# Altium schematic sheet Pro_Micro_582V0.1.SchDoc
size A3; SheetNumber: 1; SheetTotal: 1
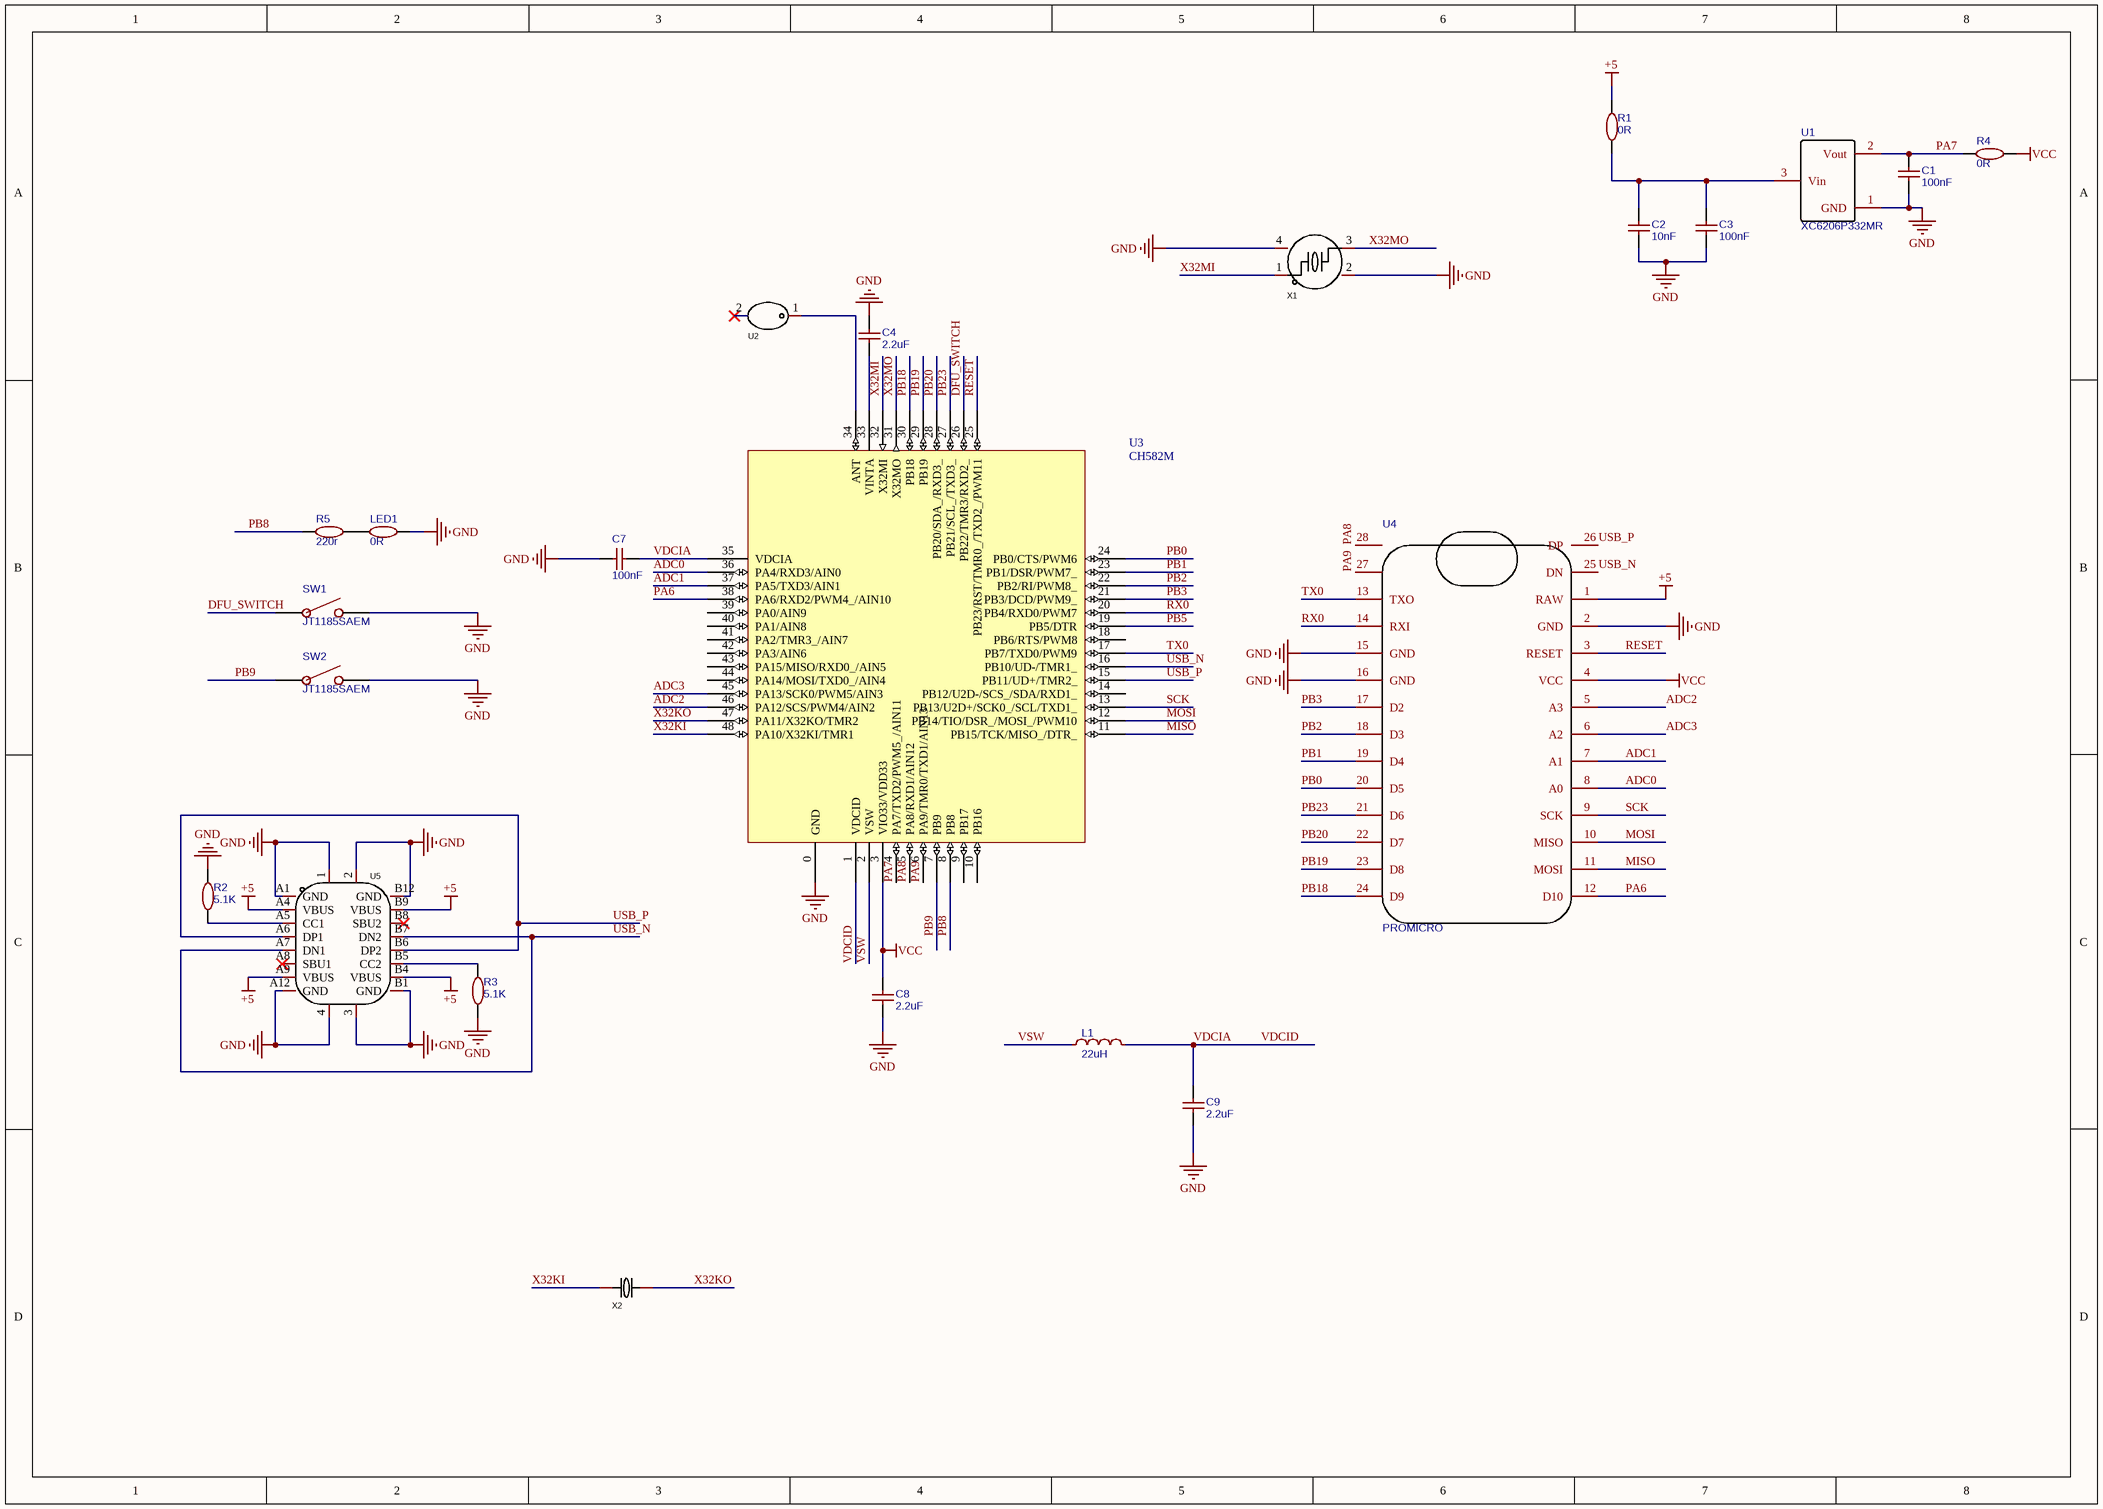
[diagram p0: Pro_Micro_582V0.1.SchDoc]

## Parts
C1  100nF  [C0402]
C2  10nF  [C0402]
C3  100nF  [C0402]
C4  2.2uF  [C0402]
C7  100nF  [C0402]
C8  2.2uF  [C0402]
C9  2.2uF  [C0402]
L1  22uH  [L0805]
LED1  0R  [C0402]
R1  0R  [R0402]
R2  5.1K  [R0402]
R3  5.1K  [R0402]
R4  0R  [R0402]
R5  220r  [C0402]
SW1  JT1185SAEM  [SW-SMD_L3.9-W2.9-P4.15-LS5.0]
SW2  JT1185SAEM  [SW-SMD_L3.9-W2.9-P4.15-LS5.0]
U1  XC6206P332MR  [SOT-23-3_L2.9-W1.6-P1.90-LS2.8-BR]
U2  RFANT3216120A5T  [FILTER-SMD_1206-2P-L3.2-W1.6-L]  (value not drawn)
U3  CH582M  [QFN48_5X5]
U4  PROMICRO  [PROMICRO邮票孔]
U5  20009-UCAF001-X  [TYPE-C-SMD_20009-UCAF001-X]  (value not drawn)
X1  X201632MOB4SI  [CRYSTAL-SMD_4P-L2.0-W1.6-BL-2]  (value not drawn)
X2  SC-32S32.768kHz20PPM12.5pF  [OSC-SMD_L3.2-W1.5]  (value not drawn)

## Nets
+5: R1.2 U4.1(RAW) U5.A4(VBUS) U5.A9(VBUS) U5.B4(VBUS) U5.B9(VBUS)
GND: C1.1 C2.1 C3.1 C4.2 C7.2 C8.1 C9.1 LED1.1 R2.2 R3.2 SW1.2 SW2.2 U1.1(GND) U3.0(GND) U4.2(GND) U4.15(GND) U4.16(GND) U5.1 U5.2 U5.3 U5.4 U5.A1(GND) U5.A12(GND) U5.B1(GND) U5.B12(GND) X1.2(GND) X1.4(GND)
VCC: C8.2 R4.1 U3.3(VIO33/VDD33) U4.4(VCC)
ADC0: U3.36(PA4/RXD3/AIN0) U4.8(A0)
ADC1: U3.37(PA5/TXD3/AIN1) U4.7(A1)
ADC2: U3.46(PA12/SCS/PWM4/AIN2) U4.5(A3)
ADC3: U3.45(PA13/SCK0/PWM5/AIN3) U4.6(A2)
DFU_SWITCH: SW1.1 U3.26(PB22/TMR3/RXD2_)
MISO: U3.11(PB15/TCK/MISO_/DTR_) U4.11(MOSI)
MOSI: U3.12(PB14/TIO/DSR_/MOSI_/PWM10) U4.10(MISO)
PA6: U3.38(PA6/RXD2/PWM4_/AIN10) U4.12(D10)
PA7: C1.2 R4.2 U1.2(Vout) U3.4(PA7/TXD2/PWM5_/AIN11)
PA8: U3.5(PA8/RXD1/AIN12) U4.28
PA9: U3.6(PA9/TMR0/TXD1/AIN13) U4.27
PB0: U3.24(PB0/CTS/PWM6) U4.20(D5)
PB1: U3.23(PB1/DSR/PWM7_) U4.19(D4)
PB2: U3.22(PB2/RI/PWM8_) U4.18(D3)
PB3: U3.21(PB3/DCD/PWM9_) U4.17(D2)
PB5: U3.19(PB5/DTR)
PB8: R5.1 U3.8(PB8)
PB9: SW2.1 U3.7(PB9)
PB18: U3.30(PB18) U4.24(D9)
PB19: U3.29(PB19) U4.23(D8)
PB20: U3.28(PB20/SDA_/RXD3_) U4.22(D7)
PB23: U3.27(PB21/SCL_/TXD3_) U4.21(D6)
RESET: U3.25(PB23/RST/TMR0_/TXD2_/PWM11) U4.3(RESET)
RX0: U3.20(PB4/RXD0/PWM7) U4.14(RXI)
SCK: U3.13(PB13/U2D+/SCK0_/SCL/TXD1_) U4.9(SCK)
TX0: U3.17(PB7/TXD0/PWM9) U4.13(TXO)
USB_N: U3.16(PB10/UD-/TMR1_) U4.25(DN) U5.A7(DN1) U5.B7(DN2)
USB_P: U3.15(PB11/UD+/TMR2_) U4.26(DP) U5.A6(DP1) U5.B6(DP2)
VDCIA: C7.1 C9.2 L1.2 U3.1(VDCID) U3.35(VDCIA)  [also labelled VDCID]
VSW: L1.1 U3.2(VSW)
X32KI: U3.48(PA10/X32KI/TMR1) X2.1
X32KO: U3.47(PA11/X32KO/TMR2) X2.2
X32MI: U3.32(X32MI) X1.1
X32MO: U3.31(X32MO) X1.3
NetC2_2: C2.2 C3.2 R1.1 U1.3(Vin)
NetC4_1: C4.1 U3.33(VINTA)
NetLED1_2: LED1.2 R5.2
NetR2_1: R2.1 U5.A5(CC1)
NetR3_1: R3.1 U5.B5(CC2)
NetU2_1: U2.1 U3.34(ANT)

Not connected (* = marked no-connect by the designer): U2 2*; U3 9(PB17) 10(PB16) 14(PB12/U2D-/SCS_/SDA/RXD1_) 18(PB6/RTS/PWM8) 39(PA0/AIN9) 40(PA1/AIN8) 41(PA2/TMR3_/AIN7) 42(PA3/AIN6) 43(PA15/MISO/RXD0_/AIN5) 44(PA14/MOSI/TXD0_/AIN4); U5 A8(SBU1)* B8(SBU2)*

## Library data of the parts
C1-C4 C7-C9 = 电容: BOM_Manufacturer: YAGEO; BOM_Manufacturer Part: CC0805KKX5R6BB106; nameAlias: Capacitance; BOM_Supplier: LCSC; BOM_Supplier Part: C89832; spicePre: C; spiceSymbolName: CC0805KKX5R6BB106
L1 = 22uH: BOM_Manufacturer: TAIYO YUDEN(太诱); BOM_Manufacturer Part: CBC2012T220K; nameAlias: Inductance; Contributor: LCSC; BOM_Supplier: LCSC; BOM_Supplier Part: C223184; BOM_JLCPCB Part Class: Extended Part; spicePre: L; spiceSymbolName: CBC2012T220K
LED1 R1-R5 = 电阻: BOM_Manufacturer: UniOhm; BOM_Manufacturer Part: 0603WAF1002T5E; nameAlias: Resistance; Resistance (Ohms): 10K; BOM_Supplier: LCSC; BOM_Supplier Part: C25804; BOM_JLCPCB Part Class: Basic Part; spicePre: R; spiceSymbolName: 0603WAF1002T5E
SW1 SW2 = JT1185SAEM: BOM_Manufacturer: NAMAE(韩国南涯); Contributor: LCSC; BOM_Supplier: LCSC; BOM_Supplier Part: C465068; BOM_Manufacturer Part: JT1185SAEM; BOM_JLCPCB Part Class: Extended Part; spicePre: S; spiceSymbolName: JT1185SAEM
U1 = XC6206P332MR: BOM_Manufacturer: TOREX; BOM_Supplier: LCSC; BOM_Manufacturer Part: XC6206P332MR; BOM_Supplier Part: C5446; BOM_JLCPCB Part Class: Basic Part; spicePre: U; spiceSymbolName: XC6206P332MR
U2 = RFANT3216120A5T: Manufacturer: Walsin(华新科); Add into BOM: yes; Antenna Type: 芯片天线; VSWR: 2; Name: RFANT3216120A5T; Symbol: RFANT3216120A5T; Device: RFANT3216120A5T; LCSC Part Name: RFANT3216120A5T; Supplier Part: C127629; Manufacturer Part: RFANT3216120A5T; Supplier Footprint: SMD,3.2x1.6x1.2mm; JLCPCB Part Class: Extended Part; Datasheet: https://atta.szlcsc.com/upload/public/pdf/source/20180326/C127629_E7A81F7A36316F7BB6F0FA74BB27F225.pdf; Supplier: LCSC; Convert to PCB: yes; Central Frequency: -; Bandwidth: -; Peak Gain: -; Polarization Type: -; Impedance: -; Power capacity: -; Operating Temperature: -40℃~+85℃
U3 = CH582M: RISC-V MCU with BLE/2*USB/ADC/PWM/SPI/I2C/4*UART
U4 = PROMICRO: Contributor: KongC; spicePre: U; spiceSymbolName: PROMICRO
U5 = 20009-UCAF001-X: Manufacturer: MINTRON(明硕); Add into BOM: yes; Name: 20009-UCAF001-X; Symbol: 20009-UCAF001-X; Device: 20009-UCAF001-X; LCSC Part Name: TYPE C; Supplier Part: C3148200; Manufacturer Part: 20009-UCAF001-X; Supplier Footprint: SMD; JLCPCB Part Class: Extended Part; Datasheet: https://atta.szlcsc.com/upload/public/pdf/source/20220705/4C04992B6F70FB490BC74B4779796E6C.pdf; Supplier: LCSC; Convert to PCB: yes
X1 = X201632MOB4SI: Manufacturer: YXC(扬兴晶振); Name: 32MHz; Add into BOM: yes; Crystal Type: 贴片无源晶振; Value: 32MHz; Frequency Tolerance: ±10ppm; Frequency Stability: ±20ppm; Load Capacitance: 12pF; Symbol: X201632MOB4SI; Device: X201632MOB4SI; LCSC Part Name: YSX211SL 32MHz ±10ppm 12pF; Supplier Part: C2682773; Manufacturer Part: X201632MOB4SI; Supplier Footprint: SMD2016-4P; JLCPCB Part Class: Extended Part; Datasheet: https://atta.szlcsc.com/upload/public/pdf/source/20210329/C108154_97241DDF47B5B71D7D93F8906D63DA2F.pdf; Supplier: LCSC; Convert to PCB: yes; Operating Temperature: -40℃~+85℃
X2 = SC-32S32.768kHz20PPM12.5pF: Manufacturer: Seiko(精工); Add into BOM: yes; Name: -; Symbol: SC-32S32.768kHz20PPM12.5pF; Device: SC-32S32.768kHz20PPM12.5pF; LCSC Part Name: 32.768kHz 20PPM 12.5pF; Supplier Part: C97606; Manufacturer Part: SC-32S32.768kHz20PPM12.5pF; Supplier Footprint: SMD3215-2P; JLCPCB Part Class: Extended Part; Datasheet: https://atta.szlcsc.com/upload/public/pdf/source/20170713/C97606_1499914220652816606.pdf; Supplier: LCSC; Convert to PCB: yes; Crystal Type: -; Value: -; Load Capacitance: -; Operating Temperature: -